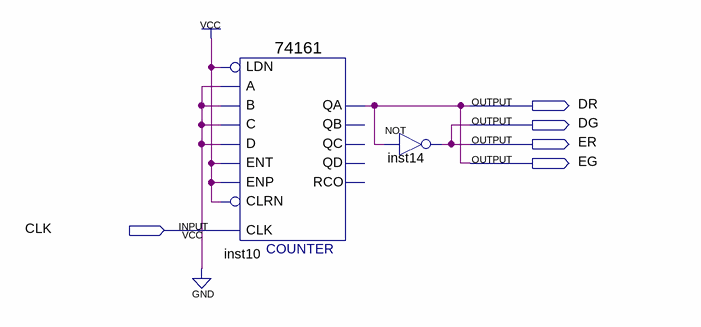
[diagram p0: schematic sheet]
// Quartus schematic Switch.bdf as structural Verilog: 2 symbols, 5 pins
module Switch (
  input  CLK,
  output DR,
  output DG,
  output ER,
  output EG
);

  \74161  inst10 (
    .CLRN(1'b1), .CLK(CLK), .ENP(1'b1), .LDN(1'b1), .A(1'b0), .D(1'b0), .ENT(1'b1), .B(1'b0), .C(1'b0),
    .QA(DR));  // open: QD, QC, QB, RCO
  not inst14 (DG, DR);

  assign EG = DR;
  assign ER = DG;
endmodule
